# Altium project STM32_display_test_board.PrjPcb (part 2 of 2)

## Sheet Connect.SchDoc
size A3; SheetNumber: 3; SheetTotal: 3
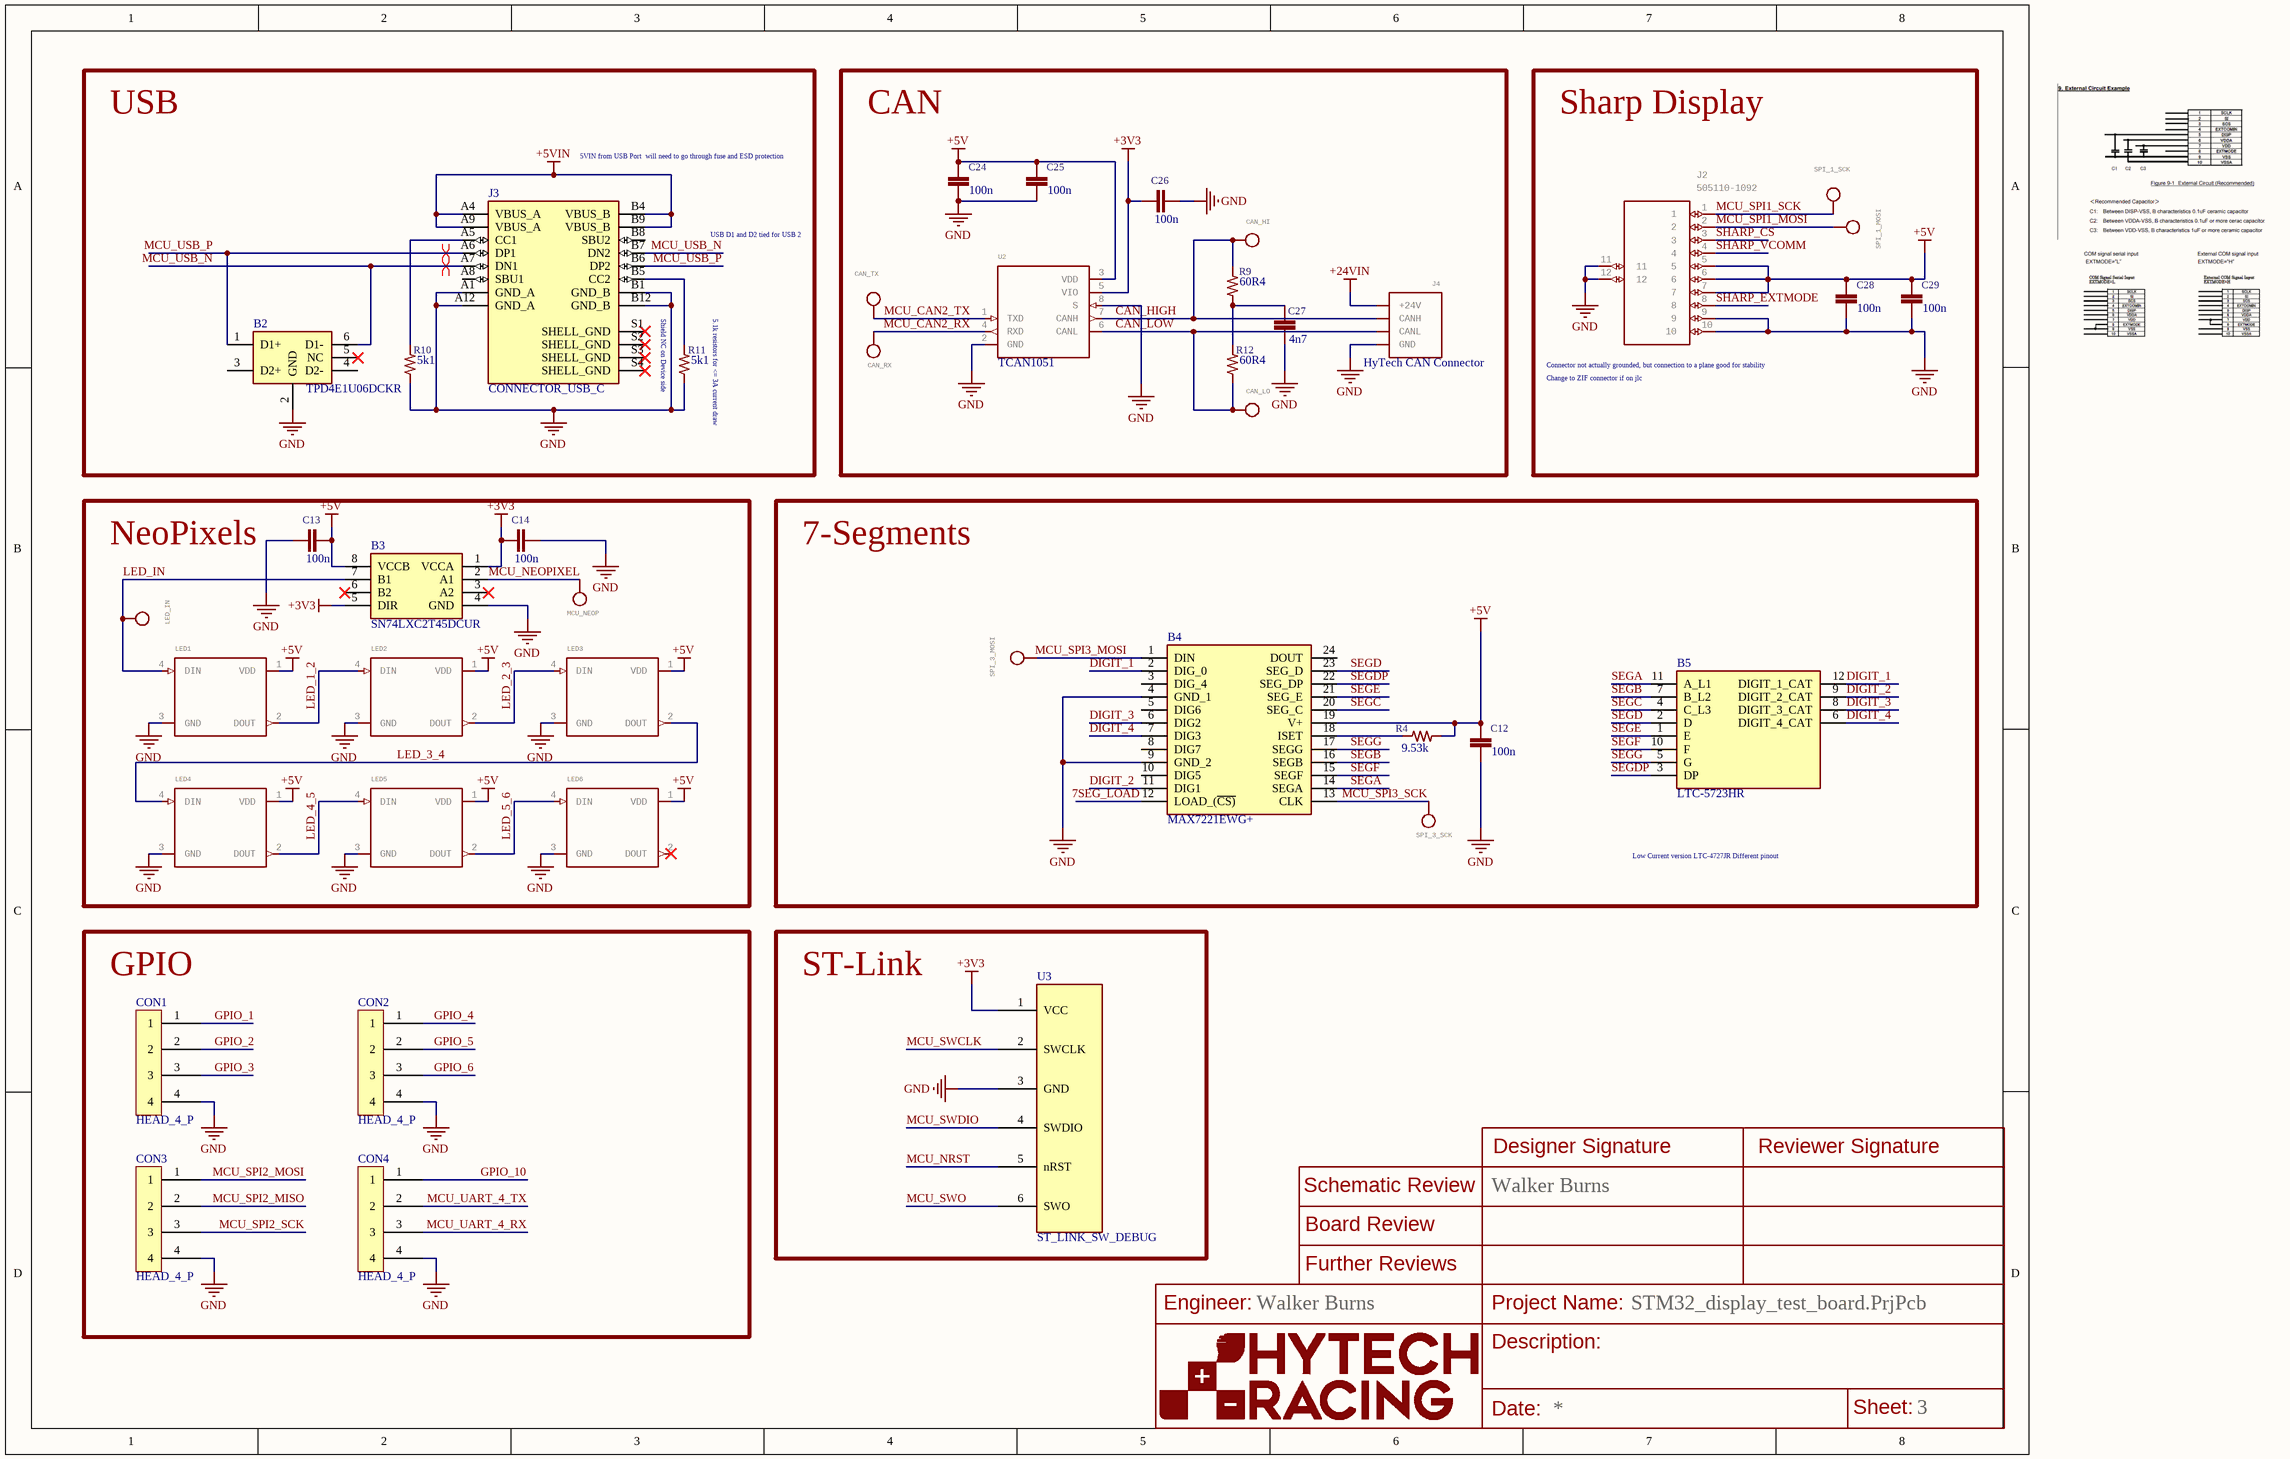
[diagram p4: Connect.SchDoc]

### Parts
B2  TPD4E1U06DCKR  [SC-70-6]
B3  SN74LXC2T45DCUR  [VSSOP-8]
B4  MAX7221EWG+  [SOIC-24]
B5  LTC-5723HR  [7SEGMENT_DISP_12_P_TH]
C12  100n  [0402_CAP]
C13  100n  [0402_CAP]
C14  100n  [0402_CAP]
C24  100n  [0402_CAP]
C25  100n  [0402_CAP]
C26  100n  [0402_CAP]
C27  4n7  [0603-CAP]
C28  100n  [0402_CAP]
C29  100n  [0402_CAP]
CAN_HI  Test Point for Probing  [5015]  (value not drawn)
CAN_LO  Test Point for Probing  [5015]  (value not drawn)
CAN_RX  Test Point for Probing  [5015]  (value not drawn)
CAN_TX  Test Point for Probing  [5015]  (value not drawn)
CON1  HEAD_4_P  [1X04]
CON2  HEAD_4_P  [1X04]
CON3  HEAD_4_P  [1X04]
CON4  HEAD_4_P  [1X04]
FRAME3  HyTech Racing Frame (ANSI Size A)  Prints on US Letter Landscape 8.5" by 11"   Fill Engineer/Description Fields with Text using the following settings:  Size: 0.1  Ratio: 8%  Line Distance: 50%  Font: Proportional  Layer: 94 Symbol  (value not drawn)
J2  505110-1092  [MOLEX_FPC_CLAMSHELL_10]
J3  CONNECTOR_USB_C  [VALCON_USB_C]
J4  HyTech CAN Connector  [MOLEX_MICROFIT_SMD_RIGHTANGLE_04_DUAL]
LED1  IN-PI55QATPRPGPBPW-40  Neopixel RGBW LED  Datasheet  [NEOPIXEL]  (value not drawn)
LED2  IN-PI55QATPRPGPBPW-40  Neopixel RGBW LED  Datasheet  [NEOPIXEL]  (value not drawn)
LED3  IN-PI55QATPRPGPBPW-40  Neopixel RGBW LED  Datasheet  [NEOPIXEL]  (value not drawn)
LED4  IN-PI55QATPRPGPBPW-40  Neopixel RGBW LED  Datasheet  [NEOPIXEL]  (value not drawn)
LED5  IN-PI55QATPRPGPBPW-40  Neopixel RGBW LED  Datasheet  [NEOPIXEL]  (value not drawn)
LED6  IN-PI55QATPRPGPBPW-40  Neopixel RGBW LED  Datasheet  [NEOPIXEL]  (value not drawn)
LED_IN  Test Point for Probing  [5015]  (value not drawn)
MCU_NEOP  Test Point for Probing  [5015]  (value not drawn)
R4  9.53k  [0603-RES]
R9  60R4  [0603-RES]
R10  5k1  [0603-RES]
R11  5k1  [0603-RES]
R12  60R4  [0603-RES]
SPI_1_MOSI  Test Point for Probing  [5015]  (value not drawn)
SPI_1_SCK  Test Point for Probing  [5015]  (value not drawn)
SPI_3_MOSI  Test Point for Probing  [5015]  (value not drawn)
SPI_3_SCK  Test Point for Probing  [5015]  (value not drawn)
U2  TCAN1051  [SOIC-08(NARROW,0-15")]
U3  ST_LINK_SW_DEBUG  [HEADER_6_P]

### Blocks framed on the sheet
USB: B2 J3 R10 R11
CAN: C24-C27 CAN_HI CAN_LO CAN_RX CAN_TX J4 R9 R12 U2
Sharp Display: C28 C29 J2 SPI_1_MOSI SPI_1_SCK
NeoPixels: B3 C13 C14 LED1-LED6 LED_IN MCU_NEOP
7-Segments: B4 B5 C12 R4 SPI_3_MOSI SPI_3_SCK
GPIO: CON1-CON4
ST-Link: U3

### Nets
+3V3: B3.1(VCCA) B3.5(DIR) C14.2 C26.2 U2.5(VIO) U3.1(VCC)
+5V: B3.8(VCCB) B4.19(V+) C12.2 C13.1 C24.2 C25.2 C28.2 C29.2 J2.5 J2.6 J2.7 LED1.1(VDD) LED2.1(VDD) LED3.1(VDD) LED4.1(VDD) LED5.1(VDD) LED6.1(VDD) R4.2 U2.3(VDD)
+5VIN: J3.A4(VBUS_A) J3.A9(VBUS_A) J3.B4(VBUS_B) J3.B9(VBUS_B)
+24VIN: J4.1(+24V)
GND: B2.2(GND) B3.4(GND) B4.4(GND_1) B4.9(GND_2) C12.1 C13.2 C14.1 C24.1 C25.1 C26.1 C27.1 C28.1 C29.1 CON1.4 CON2.4 CON3.4 CON4.4 J2.9 J2.10 J2.11 J2.12 J3.A1(GND_A) J3.A12(GND_A) J3.B1(GND_B) J3.B12(GND_B) J4.2(GND) LED1.3(GND) LED2.3(GND) LED3.3(GND) LED4.3(GND) LED5.3(GND) LED6.3(GND) R10.2 R11.2 U2.2(GND) U2.8(S) U3.3(GND)
7SEG_LOAD: B4.12(LOAD_(~{CS)})
CAN_HIGH: CAN_HI.1 J4.4(CANH) R9.1 U2.7(CANH)
CAN_LOW: CAN_LO.1 J4.3(CANL) R12.2 U2.6(CANL)
DIGIT_1: B4.2(DIG_0) B5.12(DIGIT_1_CAT)
DIGIT_2: B4.11(DIG1) B5.9(DIGIT_2_CAT)
DIGIT_3: B4.6(DIG2) B5.8(DIGIT_3_CAT)
DIGIT_4: B4.7(DIG3) B5.6(DIGIT_4_CAT)
GPIO_1: CON1.1
GPIO_2: CON1.2
GPIO_3: CON1.3
GPIO_4: CON2.1
GPIO_5: CON2.2
GPIO_6: CON2.3
GPIO_10: CON4.1
LED_1_2: LED1.2(DOUT) LED2.4(DIN)
LED_2_3: LED2.2(DOUT) LED3.4(DIN)
LED_3_4: LED3.2(DOUT) LED4.4(DIN)
LED_4_5: LED4.2(DOUT) LED5.4(DIN)
LED_5_6: LED5.2(DOUT) LED6.4(DIN)
LED_IN: B3.7(B1) LED1.4(DIN) LED_IN.1
MCU_CAN2_RX: CAN_RX.1 U2.4(RXD)
MCU_CAN2_TX: CAN_TX.1 U2.1(TXD)
MCU_NEOPIXEL: B3.2(A1) MCU_NEOP.1
MCU_NRST: U3.5(nRST)
MCU_SPI1_MOSI: J2.2 SPI_1_MOSI.1
MCU_SPI1_SCK: J2.1 SPI_1_SCK.1
MCU_SPI2_MISO: CON3.2
MCU_SPI2_MOSI: CON3.1
MCU_SPI2_SCK: CON3.3
MCU_SPI3_MOSI: B4.1(DIN) SPI_3_MOSI.1
MCU_SPI3_SCK: B4.13(CLK) SPI_3_SCK.1
MCU_SWCLK: U3.2(SWCLK)
MCU_SWDIO: U3.4(SWDIO)
MCU_SWO: U3.6(SWO)
MCU_UART_4_RX: CON4.3
MCU_UART_4_TX: CON4.2
MCU_USB_N: B2.6(D1-) J3.A7(DN1) J3.B7(DN2)
MCU_USB_P: B2.1(D1+) J3.A6(DP1) J3.B6(DP2)
SEGA: B4.14(SEGA) B5.11(A_L1)
SEGB: B4.16(SEGB) B5.7(B_L2)
SEGC: B4.20(SEG_C) B5.4(C_L3)
SEGD: B4.23(SEG_D) B5.2(D)
SEGDP: B4.22(SEG_DP) B5.3(DP)
SEGE: B4.21(SEG_E) B5.1(E)
SEGF: B4.15(SEGF) B5.10(F)
SEGG: B4.17(SEGG) B5.5(G)
SHARP_CS: J2.3
SHARP_EXTMODE: J2.8
SHARP_VCOMM: J2.4
NetB4_18: B4.18(ISET) R4.1
NetC27_2: C27.2 R9.2 R12.1
NetJ3_A5: J3.A5(CC1) R10.1
NetJ3_B5: J3.B5(CC2) R11.1

Not connected (* = marked no-connect by the designer): B2 3(D2+) 4(D2-) 5(NC)*; B3 3(A2)* 6(B2)*; B4 3(DIG_4) 5(DIG6) 8(DIG7) 10(DIG5) 24(DOUT); J3 A8(SBU1) B8(SBU2) S1(SHELL_GND)* S2(SHELL_GND)* S3(SHELL_GND)* S4(SHELL_GND)*; LED6 2(DOUT)*

### Layout directives
differential pair: MCU_USB_N, MCU_USB_P

### Notes on the sheet
- 5VIN from USB Port  will need to go through fuse and ESD protection
- USB D1 and D2 tied for USB 2
- (near R11) Shield NC on Device side
- (near R11) 5.1k resistors for <= 3A current draw
- (near J2) Connector not actually grounded, but connection to a plane good for stability
- (near J2) Change to ZIF connector if on jlc
- Low Current version LTC-4727JR Different pinout
- (in symbol FRAME) Designer Signature; Reviewer Signature; Schematic Review; Board Review; Further Reviews; Engineer:; Project Name:; Description:; Date:; Sheet:

### Library data of the parts
B2 = TPD4E1U06DCKR: Quad-Channel High-Speed ESD Protection Device; Manufacturer_Name: Texas Instruments; Geometry.Height: 1.1mm; Mouser Part Number: 595-TPD4E1U06DCKR; Mouser Price/Stock: https://www.mouser.co.uk/ProductDetail/Texas-Instruments/TPD4E1U06DCKR?qs=FBI%252BX3tnPf27UOVCu86Dnw%3D%3D; Manufacturer_Part_Number: TPD4E1U06DCKR; Datasheet Link: http://www.ti.com/lit/gpn/tpd4e1u06
B3 = LEVEL_SHIFTER_3V3_TO_5V: Translation - Voltage Levels 2-bit dual supply transceiver with configurable voltage-level shifting and 3-state outputs; Manufacturer_Name: Texas Instruments; Geometry.Height: 0.9mm; Mouser Part Number: 595-SN74LXC2T45DCUR; Mouser Price/Stock: https://www.mouser.co.uk/ProductDetail/Texas-Instruments/SN74LXC2T45DCUR?qs=TCDPyi3sCW3DKJ9sPzuW6Q%3D%3D; Manufacturer_Part_Number: SN74LXC2T45DCUR; Datasheet Link: https://www.ti.com/lit/ds/symlink/sn74lxc2t45.pdf?ts=1639472823475&ref_url=https%253A%252F%252Fwww.ti.com%252Fproduct%252FSN74LXC2T45%253FkeyMatch%253DSN74LXC2T45DCUR%2526tisearch%253Dsearch-everything%2526usecase%253DOPN
B4 = MAX7221EWG+: MAX7221EWG+, LED Display Driver, 8-Digits 64-Segments, 4  5.5 V, 24-Pin SOIC W; Manufacturer_Name: Analog Devices; Geometry.Height: 2.65mm; Mouser Part Number: 700-MAX7221EWG; Mouser Price/Stock: https://www.mouser.co.uk/ProductDetail/Analog-Devices-Maxim-Integrated/MAX7221EWG%2b?qs=1THa7WoU59EcwjgGV%252Bu7MA%3D%3D; Manufacturer_Part_Number: MAX7221EWG+; Datasheet Link: http://datasheets.maximintegrated.com/en/ds/MAX7219-MAX7221.pdf
B5 = LED_7_SEGMENT_4_DIGIT: LED Displays & Accessories 4 Digit, Red Normal Current, Common  Cathode; Manufacturer_Name: Lite-On; Manufacturer_Part_Number: LTC-4627JR; Geometry.Height: 7.25mm; Mouser Part Number: 859-LTC-4627JR; Mouser Price/Stock: https://www.mouser.co.uk/ProductDetail/Lite-On/LTC-4627JR?qs=WxFF5lh7QM3%252BoGt5Rn2nWQ%3D%3D; Datasheet Link: https://componentsearchengine.com/Datasheets/1/LTC-4627JR.pdf
C12-C14 C24-C26 C28 C29 = CAPACITOR_?_*0402: MANUFACTURER: Yageo; MPN: CC0603KRX7R0BB104; MPN: CC0603KRX7R0BB103; MANUFACTURER: KEMET; MPN: C0603C823K8RACTU; MANUFACTURER: Vishay Vitramon; MPN: VJ0603Y104JXQPW1BC; MPN: VJ0603Y224JXQCW1BC; MPN: CC0603KRX7R6BB103; MPN: VJ0603A150FXQPW1BC; MPN: CC0603KRX7R6BB105; MANUFACTURER: Murata Electronics; MPN: GRM188R61A226ME15D; MANUFACTURER: Würth Elektronik; MPN: 885012006016; MPN: 885012206012; MANUFACTURER: Samsung Electro-Mechanics; MPN: CL10A475KP8NNNC; MPN: 885012006013; MPN: C0603C683K8RACTU; MANUFACTURER: Kyocera AVX; MPN: 0201ZA820JAT2A; MPN: CL10B104KA8NNNC; MANUFACTURER: Walsin Technology Corporation; MPN: 0603B224K250CT; MPN: CC0603KRX7R8BB122; MPN: GRM188R61E106MA73D; MPN: CL10B105KA8NNNC; MANUFACTURER: TDK Corporation; MPN: C1608X5R1E475K080AC; MPN: 06033C473K4Z2A; MANUFACTURER: Taiyo Yuden; MPN: GMK107B7104KAHT; MPN: C1608X7R1V224K080AB; MPN: C1608X7R1V105K080AE; MPN: CC0603KRX7R9BB104; MPN: C1608C0G1H103J080AA; MPN: UMK107BJ105KA-T; MPN: CL10B471JB8NNNC; GateName_1: G$1; DeviceName: 0603; CAPACITANCE: 0.1µF; DKPN: 311-1523-1-ND; MOPN: 603-CC603KRX7R0BB104; TOLERANCE: 10%; VOLTAGE: 100V; CAPACITANCE: 10nF; DKPN: 311-1788-1-ND; MOPN: 603-CC603KRX7R0BB103; CAPACITANCE: 0.082µF; DKPN: 399-17417-2-ND; MOPN: 80-C0603C823K8R; VOLTAGE: 10V; DKPN: 720-1688-1-ND; MOPN: 77-VJ0603Y104JXQPBC; TOLERANCE: 5%; CAPACITANCE: 0.22µF; DKPN: 720-VJ0603Y224JXQCW1BCTR-ND; MOPN: 77-VJ0603Y224JXQCBC; DKPN: 311-4054-1-ND; MOPN: 603-CC603KRX7R6BB103; CAPACITANCE: 15pF; DKPN: 720-VJ0603A150FXQPW1BCCT-ND; MOPN: 77-VJ0603A150FXQPBC; TOLERANCE: 1%; CAPACITANCE: 1µF; DKPN: 311-1796-1-ND; MOPN: 603-CC603KRX7R6BB105; CAPACITANCE: 22µF; DKPN: 490-10476-1-ND; MOPN: 81-GRM188R61A226ME5D; TOLERANCE: 20%; CAPACITANCE: 3.3nF; DKPN: 732-7759-1-ND; MOPN: 710-885012006016; CAPACITANCE: 4.7nF; DKPN: 732-7931-1-ND; MOPN: 710-885012206012; CAPACITANCE: 4.7µF; DKPN: 1276-1044-1-ND; MOPN: 187-CL10A475KP8NNNC; CAPACITANCE: 680pF; DKPN: 732-7757-1-ND; MOPN: 710-885012006013; CAPACITANCE: 68nF; DKPN: 399-C0603C683K8RAC7867CT-ND; MOPN: 80-C0603C683K8R; CAPACITANCE: 82pF; DKPN: 478-1025-1-ND; MOPN: 581-0201ZA820JAT2A; DKPN: 1276-1006-1-ND; MOPN: 187-CL10B104KA8NNNC; VOLTAGE: 25V; DKPN: 1292-1420-1-ND; MOPN: 791-0603B224K250CT; CAPACITANCE: 1.2nF; DKPN: 311-4079-2-ND; MOPN: 603-CC603KRX7R8BB122; CAPACITANCE: 10µF; DKPN: 490-7202-1-ND; MOPN: 81-GRM188R61E106MA3D; DKPN: 1276-1184-1-ND; MOPN: 187-CL10B105KA8NNNC; CAPACITANCE: 4.7uF; DKPN: 445-9050-1-ND; MOPN: 810-C1608X5R1E475K; CAPACITANCE: 47nF; DKPN: 478-6340-1-ND; MOPN: 581-06033C473K42ZA; DKPN: 587-3354-1-ND; MOPN: 963-GMK107B7104KAHT; VOLTAGE: 35V; DKPN: 445-14239-1-ND; MOPN: 810-C1608X7R1V224K0B; DKPN: 445-173625-1-ND; MOPN: 810-C1608X7R1V105KAE; DKPN: 311-1344-1-ND; MOPN: 603-CC603KRX7R9BB104; VOLTAGE: 50V; DKPN: 445-7404-1-ND; MOPN: 810-C1608C0G1H103J; CAPACITANCE: 1uF; DKPN: 587-2400-2-ND; MOPN: 963-UMK107BJ105KA-T; CAPACITANCE: 470pF; DKPN: 1276-2058-1-ND; MOPN: 187-CL10B471JB8NNNC; CAPACITANCE: 47pF; DKPN: 445-12417-1-ND; MOPN: CGA3E2NP01H470J080AA; SymbolName_1: CAPACITOR; LibraryName: HyTechDevices; DeviceSetName: CAPACITOR_?_*; Package: 0603-CAP; MANUFACTURER: YAGEO; MPN: CGA3E2NP01H470J080AA
C27 = CAPACITOR_?_*0603: MANUFACTURER: Yageo; MPN: CC0603KRX7R0BB104; MPN: CC0603KRX7R0BB103; MANUFACTURER: KEMET; MPN: C0603C823K8RACTU; MANUFACTURER: Vishay Vitramon; MPN: VJ0603Y104JXQPW1BC; MPN: VJ0603Y224JXQCW1BC; MPN: CC0603KRX7R6BB103; MPN: VJ0603A150FXQPW1BC; MPN: CC0603KRX7R6BB105; MANUFACTURER: Murata Electronics; MPN: GRM188R61A226ME15D; MANUFACTURER: Würth Elektronik; MPN: 885012006016; MPN: 885012206012; MANUFACTURER: Samsung Electro-Mechanics; MPN: CL10A475KP8NNNC; MPN: 885012006013; MPN: C0603C683K8RACTU; MANUFACTURER: Kyocera AVX; MPN: 0201ZA820JAT2A; MPN: CL10B104KA8NNNC; MANUFACTURER: Walsin Technology Corporation; MPN: 0603B224K250CT; MPN: CC0603KRX7R8BB122; MPN: GRM188R61E106MA73D; MPN: CL10B105KA8NNNC; MANUFACTURER: TDK Corporation; MPN: C1608X5R1E475K080AC; MPN: 06033C473K4Z2A; MANUFACTURER: Taiyo Yuden; MPN: GMK107B7104KAHT; MPN: C1608X7R1V224K080AB; MPN: C1608X7R1V105K080AE; MPN: CC0603KRX7R9BB104; MPN: C1608C0G1H103J080AA; MPN: UMK107BJ105KA-T; MPN: CL10B471JB8NNNC; GateName_1: G$1; DeviceName: 0603; CAPACITANCE: 0.1µF; DKPN: 311-1523-1-ND; MOPN: 603-CC603KRX7R0BB104; TOLERANCE: 10%; VOLTAGE: 100V; CAPACITANCE: 10nF; DKPN: 311-1788-1-ND; MOPN: 603-CC603KRX7R0BB103; CAPACITANCE: 0.082µF; DKPN: 399-17417-2-ND; MOPN: 80-C0603C823K8R; VOLTAGE: 10V; DKPN: 720-1688-1-ND; MOPN: 77-VJ0603Y104JXQPBC; TOLERANCE: 5%; CAPACITANCE: 0.22µF; DKPN: 720-VJ0603Y224JXQCW1BCTR-ND; MOPN: 77-VJ0603Y224JXQCBC; DKPN: 311-4054-1-ND; MOPN: 603-CC603KRX7R6BB103; CAPACITANCE: 15pF; DKPN: 720-VJ0603A150FXQPW1BCCT-ND; MOPN: 77-VJ0603A150FXQPBC; TOLERANCE: 1%; CAPACITANCE: 1µF; DKPN: 311-1796-1-ND; MOPN: 603-CC603KRX7R6BB105; CAPACITANCE: 22µF; DKPN: 490-10476-1-ND; MOPN: 81-GRM188R61A226ME5D; TOLERANCE: 20%; CAPACITANCE: 3.3nF; DKPN: 732-7759-1-ND; MOPN: 710-885012006016; CAPACITANCE: 4.7nF; DKPN: 732-7931-1-ND; MOPN: 710-885012206012; CAPACITANCE: 4.7µF; DKPN: 1276-1044-1-ND; MOPN: 187-CL10A475KP8NNNC; CAPACITANCE: 680pF; DKPN: 732-7757-1-ND; MOPN: 710-885012006013; CAPACITANCE: 68nF; DKPN: 399-C0603C683K8RAC7867CT-ND; MOPN: 80-C0603C683K8R; CAPACITANCE: 82pF; DKPN: 478-1025-1-ND; MOPN: 581-0201ZA820JAT2A; DKPN: 1276-1006-1-ND; MOPN: 187-CL10B104KA8NNNC; VOLTAGE: 25V; DKPN: 1292-1420-1-ND; MOPN: 791-0603B224K250CT; CAPACITANCE: 1.2nF; DKPN: 311-4079-2-ND; MOPN: 603-CC603KRX7R8BB122; CAPACITANCE: 10µF; DKPN: 490-7202-1-ND; MOPN: 81-GRM188R61E106MA3D; DKPN: 1276-1184-1-ND; MOPN: 187-CL10B105KA8NNNC; CAPACITANCE: 4.7uF; DKPN: 445-9050-1-ND; MOPN: 810-C1608X5R1E475K; CAPACITANCE: 47nF; DKPN: 478-6340-1-ND; MOPN: 581-06033C473K42ZA; DKPN: 587-3354-1-ND; MOPN: 963-GMK107B7104KAHT; VOLTAGE: 35V; DKPN: 445-14239-1-ND; MOPN: 810-C1608X7R1V224K0B; DKPN: 445-173625-1-ND; MOPN: 810-C1608X7R1V105KAE; DKPN: 311-1344-1-ND; MOPN: 603-CC603KRX7R9BB104; VOLTAGE: 50V; DKPN: 445-7404-1-ND; MOPN: 810-C1608C0G1H103J; CAPACITANCE: 1uF; DKPN: 587-2400-2-ND; MOPN: 963-UMK107BJ105KA-T; CAPACITANCE: 470pF; DKPN: 1276-2058-1-ND; MOPN: 187-CL10B471JB8NNNC; CAPACITANCE: 47pF; DKPN: 445-12417-1-ND; MOPN: CGA3E2NP01H470J080AA; SymbolName_1: CAPACITOR; LibraryName: HyTechDevices; DeviceSetName: CAPACITOR_?_*; Package: 0603-CAP; MANUFACTURER: YAGEO; MPN: CGA3E2NP01H470J080AA
CAN_HI CAN_LO CAN_RX CAN_TX LED_IN MCU_NEOP SPI_1_MOSI SPI_1_SCK SPI_3_MOSI SPI_3_SCK = TEST_POINT: MANUFACTURER: Keystone Electronics; GateName_1: G$1; DKPN: 36-5015CT-ND; MOPN: 534-5015; SymbolName_1: TEST_POINT; LibraryName: HyTechDevices; DeviceSetName: TEST_POINT; Package: 5015; MPN: 5015
CON1-CON4 = CONNECTOR_HEADER_4: 4 Pin Standard Header
FRAME3 = FRAME: GateName_1: O; SymbolName_1: FRAME; LibraryName: HyTechFrames; DeviceSetName: FRAME
J2 = CONNECTOR-10_MOLEX_FPC_CLAMSHELL: Manufacturer_Name: Molex; GateName_1: G$1; SymbolName_1: 505110-1092; LibraryName: 505110-1092; DeviceSetName: 505110-1092; Package: 5051101092; Mouser_Part_Number: 538-505110-1092; Mouser_Price-Stock: https://www.mouser.co.uk/ProductDetail/Molex/505110-1092?qs=BA62vJVifGrjJfo6A8tlOw%3D%3D; Manufacturer_Part_Number: 505110-1092; Height: 0mm
J3 = CONNECTOR_USB_C: CSP-USC16-TR Valcon USB Type C Surface Mount PCB Socket; SnapEDA_Link: https://www.snapeda.com/parts/CSP-USC16-TR/Valcon/view-part/?ref=snap; MF: Valcon; MP: CSP-USC16-TR; Availability: In Stock; Price: None; Value: *; Check_prices: https://www.snapeda.com/parts/CSP-USC16-TR/Valcon/view-part/?ref=eda; Package: None; Purchase-URL: https://pricing.snapeda.com/search/part/CSP-USC16-TR/?ref=eda
J4 = CONNECTOR-CAN_?_*μF_S_RA: MANUFACTURER: Molex; MPN: 0430450411; GateName_1: G$1; SymbolName_1: CONNECTOR_CAN; DKPN: WM1832CT-ND; MOPN: 538-43045-0411; DeviceName: μF_S_RA; LibraryName: HyTechDevices; DeviceSetName: CONNECTOR-CAN_?_*; Package: MOLEX_MICROFIT_SMD_RIGHTANGLE_04_DUAL
LED1-LED6 = NEOPIXEL_*IN-PI55QATPRPGPBPW-40: MANUFACTURER: Inolux; GateName_1: G$1; DKPN: 1830-1210-2-ND; MOPN: 743-I55QATPRPGPBPW40; SymbolName_1: NEOPIXEL; DeviceName: IN-PI55QATPRPGPBPW-40; LibraryName: HyTechDevices; DeviceSetName: NEOPIXEL_*; Package: NEOPIXEL; MPN: IN-PI55QATPRPGPBPW-40
R4 R9-R12 = RESISTOR_?_*0603: MANUFACTURER: Yageo; MPN: RC0603FR-070RL; MANUFACTURER: Panasonic Electronic Components; MPN: ERJ-3BWFR020V; MPN: RL0603FR-070R5L; MPN: ERJ-3EKF1131V; MANUFACTURER: Vishay Dale; MPN: CRCW06031M13FKEA; MPN: RC0603FR-071K24L; MPN: ERA-3AEB1331V; MPN: RC0603FR-071M5L; MANUFACTURER: TE Conductivity Passive Product; MPN: CPF0603B1R62E1; MPN: RC0603FR-071K65L; MPN: RC0603FR-0710RL; MPN: ERA-3AEB1022V; MPN: ERA-3AEB1052V; MPN: RC0603FR-07100RL; MPN: RC0603FR-07100KL; MPN: ERA-3ARB103V; MPN: ERA-3AEB1132V; MPN: ERA-3AEB1152V; MPN: ERJ-PB3B1242V; MPN: ERA-3AEB121V; MPN: RC0603FR-0712KL; MPN: ERJ-1GNF13R0C; MPN: ERJ-PB3B1332V; MPN: ERA-3ARW133V; MPN: RT0603BRB0714KL; MPN: CRCW060315R0FKEAHP; MPN: ERA-3AEB154V; MPN: ERA-3AEB1543V; MPN: ERA-3ARB153V; MPN: RC0603FR-0717K8L; MPN: RC0603FR-0718K7L; MPN: RC0603FR-07180RL; MANUFACTURER: TE Connectivity Passive Product; MPN: CPF-A-0603B1K0E; MPN: RC0603FR-071ML; MPN: RT0805BRD072K18L; MPN: RC0603FR-072K55L; MPN: ERJ-PB3B2741V; MPN: RC0603FR-0720KL; MPN: ERJ-PB3B2100V; MPN: ERA-3AEB2153V; MPN: RC0603FR-0722RL; MPN: ERA-3AEB2212V; MPN: RC0603FR-07240RL; MANUFACTURER: Panasonic Electronic Company; MPN: ERA-3AEB2553V; MPN: ERJ-UP3F2001V; MPN: ERJ-3RQF3R3V; MPN: RT0603BRD073K32L; MPN: ERJ-PB3D3301V; MPN: RC0603FR-073K9L; MPN: ERJ-PB3B3092V; MPN: ERA-3ARB303V; MPN: ERJ-PB3B3322V; MPN: ERA-3AEB334V; MANUFACTURER: Rohm Semiconductor; MPN: KTR03EZPF3302; MPN: RC0603FR-0736K5L; MPN: RC0603FR-07360RL; MPN: KTR03EZPF3603; MPN: RC0603FR-07374KL; MPN: RT0603BRD0739RL; MPN: ERA-3AEB4121V; MPN: RC0603FR-074K64L; MPN: RC0603FR-07402RL; MPN: ERJ-1GNF41R2C; MPN: ERJ-PB3B4122V; MPN: RC0603FR-0743KL; MPN: ERJ-PA3F4700V; MPN: ERJ-P03J5R1V; MPN: RC0603FR-075K1L; MPN: RN73C1J5R49BTD; MPN: ERJ-PB3D5491V; MPN: ERA-3AEB5901V; MPN: RT0603BRE0750RL; MPN: KTR03EZPF5103; MPN: RC0603FR-0760R4L; MPN: RC0603FR-07620RL; MPN: ERA-3AEB7322V; MPN: RT0603BRE0775KL; MANUFACTURER: Vishay Dale Thin Film; MPN: PTN0603E8351BST1; MPN: RT0603BRD078K66L; MPN: ERA-3AEB8452V; MPN: ERJ-PB3B9312V; MANUFACTURER: Rohm; MPN: KTR03EZPF3301; MPN: KTR03EZPF7502; MPN: KTR03EZPF7503; GateName_1: G$1; DeviceName: 0603; DKPN: 311-0.0HRCT-ND; MOPN: 603-RC0603FR-070RL; POWER: 0.1W; RESISTANCE: 0; TOLERANCE: 1%; VOLTAGE_CONTINUOUS: 75V; DKPN: P17461CT-ND; MOPN: 667-ERJ-3BWFR020V; POWER: 0.33W; RESISTANCE: 0.02; VOLTAGE_CONTINUOUS: 0.081V; VOLTAGE_MAX: 150V; DKPN: 311-.5QTR-ND; MOPN: 603-RL0603FR070R5L; RESISTANCE: 0.5; VOLTAGE_CONTINUOUS: 0.22V; DKPN: P1.13KHCT-ND; MOPN: 667-ERJ-3EKF1131V; RESISTANCE: 1.13k; DKPN: 541-1.13MHCT-ND; MOPN: 71-CRCW06031M13FKEA; RESISTANCE: 1.13M; VOLTAGE_MAX: 100V; DKPN: 311-1.24KHRCT-ND; MOPN: 603-RC0603FR-071K24L; RESISTANCE: 1.24k; VOLTAGE_CONTINUOUS: 11.14V; DKPN: P1.33KDBCT-ND; MOPN: 667-ERA-3AEB1331V; RESISTANCE: 1.33k; TOLERANCE: 0.1%; VOLTAGE_CONTINUOUS: 11.53V; DKPN: 311-1.50MHRCT-ND; MOPN: 603-RC0603FR-071M5L; RESISTANCE: 1.5M; DKPN: 1712-CPF0603B1R62E1TR-ND; MOPN: 279-CPF0603B1R62E1; RESISTANCE: 1.62; VOLTAGE_CONTINUOUS: 0.51V; VOLTAGE_MAX: 50V; DKPN: 311-1.65KHRCT-ND; MOPN: 603-RC0603FR-071K65L; RESISTANCE: 1.65k; VOLTAGE_CONTINUOUS: 12.85V; DKPN: 311-10.0HRCT-ND; MOPN: 603-RC0603FR-0710RL; RESISTANCE: 10; VOLTAGE_CONTINUOUS: 1.00V; DKPN: P10.2KDBCT-ND; MOPN: 667-ERA-3AEB1022V; RESISTANCE: 10.2k; VOLTAGE_CONTINUOUS: 31.94V; DKPN: P10.5KDBCT-ND; MOPN: 677-ERA-3AEB1052V; RESISTANCE: 10.5k; VOLTAGE_CONTINUOUS: 32.40V; DKPN: 311-100HRCT-ND; MOPN: 603-RC0603FR-07100RL; RESISTANCE: 100; VOLTAGE_CONTINUOUS: 3.16V; DKPN: 311-100KHRTR-ND; MOPN: 603-RC0603FR-07100KL; RESISTANCE: 100k; DKPN: P10KBDCT-ND; MOPN: 667-ERA-3ARB103V; RESISTANCE: 10k; VOLTAGE_CONTINUOUS: 31.62V; DKPN: P11.3KDBCT-ND; MOPN: 667-ERA-3AEB1132V; RESISTANCE: 11.3k; VOLTAGE_CONTINUOUS: 33.62V; DKPN: P11.5KDBCT-ND; MOPN: 667-ERA-3AEB1152V; RESISTANCE: 11.5k; VOLTAGE_CONTINUOUS: 33.91V; DKPN: P20096CT-ND; MOPN: 667-ERJ-PB3B1242V; POWER: 0.2W; RESISTANCE: 12.4k; VOLTAGE_CONTINUOUS: 49.79V; DKPN: P120DBCT-ND; MOPN: 667-ERA-3AEB121V; RESISTANCE: 120; VOLTAGE_CONTINUOUS: 3.46V; DKPN: 311-12.0KHRCT-ND; MOPN: 603-RC0603FR-0712KL; RESISTANCE: 12k; VOLTAGE_CONTINUOUS: 34.64V; DKPN: P122724CT-ND; MOPN: 667-ERJ-1GNF13R0C; POWER: 0.05W; RESISTANCE: 13; VOLTAGE_CONTINUOUS: 25V; DKPN: P20099TR-ND; MOPN: 667-ERJ-PB3B1332V; RESISTANCE: 13.3k; VOLTAGE_CONTINUOUS: 51.58V; VOLTAGE_MAX: 75k; DKPN: P13KBECT-ND; MOPN: 667-ERA-3ARW133V; RESISTANCE: 13k; TOLERANCE: 0.05%; DKPN: RT0603BRB0714KL-ND; MOPN: 603-RT0603BRB0714KL; RESISTANCE: 14k; VOLTAGE_CONTINUOUS: 37.4V; DKPN: 541-15.0STR-ND; MOPN: 71-CRCW060315R0FKEAH; RESISTANCE: 15; VOLTAGE_CONTINUOUS: 2.22V; DKPN: P150KDBCT-ND; MOPN: 667-ERA-3AEB154V; RESISTANCE: 150k; DKPN: P154KDBCT-ND; MOPN: 667-ERA-3AEB1543V; RESISTANCE: 154k; DKPN: P15KBDCT-ND; MOPN: 667-ERA-3ARB153V; RESISTANCE: 15k; VOLTAGE_CONTINUOUS: 38.73V; DKPN: 311-17.8KHRCT-ND; MOPN: 603-RC0603FR-0717K8L; RESISTANCE: 17.8k; VOLTAGE_CONTINUOUS: 42.19V; DKPN: 311-18.7KHRCT-ND; MOPN: 603-RC0603FR-0718K7L; RESISTANCE: 18.7k; VOLTAGE_CONTINUOUS: 43.24V; DKPN: 311-180HRCT-ND; MOPN: 603-RC0603FR-07180RL; RESISTANCE: 180; VOLTAGE_CONTINUOUS: 4.24V; DKPN: 1712-CPF-A-0603B1K0ETR-ND; MOPN: 279-CPF-A-0603B1K0E; POWER: 0.0625W; RESISTANCE: 1k; VOLTAGE_CONTINUOUS: 7.9V; DKPN: 311-1.00MHRCT-ND; MOPN: 603-RC0603FR-071ML; RESISTANCE: 1M; DKPN: 13-RT0805BRD072K18LTR-ND; MOPN: 603-RT0805BRD072K18L; POWER: 0.125W; RESISTANCE: 2.18k; VOLTAGE_CONTINUOUS: 16.51V; DKPN: 311-2.55KHRCT-ND; MOPN: 603-RC0603FR-072K55L; RESISTANCE: 2.55k; VOLTAGE_CONTINUOUS: 15.97V; DKPN: P20020CT-ND; MOPN: 667-ERJ-PB3B2741V; RESISTANCE: 2.74k; VOLTAGE_CONTINUOUS: 23.41V; DKPN: 311-20.0KHRTR-ND; MOPN: 603-RC0603FR-0720KL; POWER: 0.1 W; RESISTANCE: 20k; VOLTAGE_CONTINUOUS: 44.72V; DKPN: P19892CT-ND; MOPN: 667-ERJ-PB3B2100V; RESISTANCE: 210; VOLTAGE_CONTINUOUS: 6.48V; DKPN: P215KDBCT-ND; MOPN: 667-ERA-3AEB2153V; RESISTANCE: 215k; DKPN: 311-22.0HRCT-ND; MOPN: 603-RC0603FR-0722RL; RESISTANCE: 22; VOLTAGE_CONTINUOUS: 1.48V; DKPN: P22.1KDBCT-ND; MOPN: 667-ERA-3AEB2212V; RESISTANCE: 22.1k; VOLTAGE_CONTINUOUS: 47.01V; DKPN: 311-240HRCT-ND; MOPN: 603-RC0603FR-07240RL; RESISTANCE: 240; VOLTAGE_CONTINUOUS: 4.90V; DKPN: P255KDBCT-ND; MOPN: 667-ERA-3AEB2553V; RESISTANCE: 255k; DKPN: 10-ERJ-UP3F2001VTR-ND; MOPN: 667-ERJ-UP3F2001V; POWER: 0.25W; RESISTANCE: 2k; VOLTAGE_CONTINUOUS: 22.36V; DKPN: P3.3AJTR-ND; MOPN: 667-ERJ-3RQF3R3V; RESISTANCE: 3.3; VOLTAGE_CONTINUOUS: 0.57V; DKPN: YAG1651TR-ND; MOPN: 603-RT0603BRD073K32L; RESISTANCE: 3.32k; VOLTAGE_CONTINUOUS: 18.22V; DKPN: P20340TR-ND; MOPN: 667-ERJ-PB3D3301V; POWER: 0.3W; RESISTANCE: 3.3k; TOLERANCE: 0.5%; VOLTAGE_CONTINUOUS: 25.69V; VOLTAGE_MAX: 150; DKPN: 311-3.90KHRCT-ND; MOPN: 603-RC0603FR-073K9L; RESISTANCE: 3.9k; VOLTAGE_CONTINUOUS: 19.75V; DKPN: P20140CT-ND; MOPN: 667-ERJ-PB3B3092V; RESISTANCE: 30.9k; VOLTAGE_MAX: 200V; DKPN: P30KBDCT-ND; MOPN: 667-ERA-3ARB303V; RESISTANCE: 30k; VOLTAGE_CONTINUOUS: 54.77V; DKPN: P20144TR-ND; MOPN: 667-ERJ-PB3B3322V; RESISTANCE: 33.2k; VOLTAGE_CONTINUOUS: 57.61V; DKPN: P330KDBCT-ND; MOPN: 667-ERA-3AEB334V; RESISTANCE: 330k; DKPN: RHM33KAYTR-ND; MOPN: 755-KTR03EZPF3302; RESISTANCE: 33k; VOLTAGE_CONTINUOUS: 57.44V; VOLTAGE_MAX: 350V; DKPN: 311-36.5KHRCT-ND; MOPN: 603-RC0603FR-0736K5L; RESISTANCE: 36.5k; VOLTAGE_CONTINUOUS: 60.42V; DKPN: 311-360HRTR-ND; MOPN: 603-RC0603FR-07360RL; RESISTANCE: 360; VOLTAGE_CONTINUOUS: 6.00V; DKPN: RHM360KAYTR-ND; MOPN: 755-KTR03EZPF3603; RESISTANCE: 360k; VOLTAGE_CONTINUOUS: 189.74V; DKPN: 311-374KHRCT-ND; MOPN: 603-RC0603FR-07374KL; RESISTANCE: 374k; DKPN: 13-RT0603BRD0739RLTR-ND; MOPN: 603-RT0603BRD0739RL; RESISTANCE: 39; VOLTAGE_CONTINUOUS: 1.97V; DKPN: P4.12KDBCT-ND; MOPN: 667-ERA-3AEB4121V; RESISTANCE: 4.12k; VOLTAGE_CONTINUOUS: 20.30V; DKPN: 311-4.64KHRCT-ND; MOPN: 603-RC0603FR-074K64L; RESISTANCE: 4.64k; VOLTAGE_CONTINUOUS: 21.54V; DKPN: 311-402HRCT-ND; MOPN: 603-RC0603FR-07402RL; RESISTANCE: 402; VOLTAGE_CONTINUOUS: 6.34V; DKPN: P123000CT-ND; MOPN: 667-ERJ-1GNF41R2C; RESISTANCE: 41.2; DKPN: P20155CT-ND; MOPN: 667-ERJ-PB3B4122V; RESISTANCE: 41.2k; DKPN: 311-43.0KHRCT-ND; MOPN: 603-RC0603FR-0743KL; RESISTANCE: 43k; VOLTAGE_CONTINUOUS: 65.57V; DKPN: P470BYCT-ND; MOPN: 667-ERJ-PA3F4700V; RESISTANCE: 470; VOLTAGE_CONTINUOUS: 10.84V; DKPN: P16039TR-ND; MOPN: 667-ERJ-P03J5R1V; RESISTANCE: 5.1; VOLTAGE_CONTINUOUS: 1.13V; DKPN: 311-5.10KHRTR-ND; MOPN: 603-RC0603FR-075K1L; RESISTANCE: 5.1k; VOLTAGE_CONTINUOUS: 22.58V; DKPN: A124665CT-ND; MOPN: 279-RN73C1J5R49BTD; RESISTANCE: 5.49; DKPN: P20367CT-ND; MOPN: 667-ERJ-PB3D5491V; RESISTANCE: 5.49k; DKPN: P5.9KDBCT-ND; MOPN: 667-ERA-3AEB5901V; RESISTANCE: 5.9k; VOLTAGE_CONTINUOUS: 24.29V; DKPN: 13-RT0603BRE0750RLCT-ND; MOPN: 603-RT0603BRE0750RL; RESISTANCE: 50; VOLTAGE_CONTINUOUS: 2.24V; DKPN: RHM510KAYTR-ND; MOPN: 755-KTR03EZPF5103; RESISTANCE: 510k; VOLTAGE_CONTINUOUS: 225.83V; DKPN: 311-60.4HRCT-ND; MOPN: 603-RC0603FR-0760R4L; RESISTANCE: 60.4; VOLTAGE_CONTINUOUS: 2.48V; DKPN: 311-620HRCT-ND; MOPN: 603-RC0603FR-07620RL; RESISTANCE: 620; VOLTAGE_CONTINUOUS: 7.87V; DKPN: P73.2KDBCT-ND; MOPN: 667-ERA-3AEB7322V; RESISTANCE: 73.2k; DKPN: RT0603BRE0775KL-ND; MOPN: 603-RT0603BRE0775KL; DKPN: 764-1461-2-ND; MOPN: 71-PTN0603E8351BST1; POWER: 0.15W; RESISTANCE: 8.35k; VOLTAGE_CONTINUOUS: 28.90V; DKPN: YAG4603TR-ND; MOPN: 603-RT0603BRD078K66L; RESISTANCE: 8.66k; VOLTAGE_CONTINUOUS: 29.43V; DKPN: P84.5KDBCT-ND; MOPN: 667-ERA-3AEB8452V; RESISTANCE: 84.5k; DKPN: P20197CT-ND; MOPN: 667-ERJ-PB3B9312V; RESISTANCE: 93.1k; VOLTAGE_CONTINUOUS: 136V; RESISTANCE: DNP; DKPN: RHM3.3KAYTR-ND; MOPN: 755-KTR03EZPF3301; VOLTAGE_CONTINUOUS: 18.17V; DKPN: RHM75KAYTR-ND; MOPN: 755-KTR03EZPF7502; RESISTANCE: 750k; VOLTAGE_CONTINUOUS: 273.86V; DKPN: RHM750KAYTR-ND; MOPN: 755-KTR03EZPF7503; VOLTAGE_CONTINUOUS: 86.60V; SymbolName_1: RESISTOR; LibraryName: HyTechDevices; DeviceSetName: RESISTOR_?_*; Package: 0603-RES; VOLTAGE_MAX: 75V; MANUFACTURER: YAGEO; VOLTAGE_CONTINUOUS: 150V; VOLTAGE_CONTINUOUS: 50V; RESISTANCE: 75k
U2 = TCAN1051*V-Q1: MANUFACTURER: Texas Instruments; MPN: TCAN1051HGVDRQ1; GateName_1: G$1; SymbolName_1: CAN_TRANSCIEVER_TCAN1051*V; DKPN: 296-49935-1-ND; MOPN: 595-TCAN1051HGVDQ1; LibraryName: HyTechDevices; DeviceSetName: TCAN1051*V-Q1; Package: SOIC-08(NARROW,0.15")
U3 = CONNECTOR_ST_LINK

## Nets that join several sheets
+3V3: MCU (14 pins), Power (6 pins), Connect (6 pins)
+5V: Power (5 pins), Connect (19 pins)
+5VIN: Power (5VIN.1 F1.1), Connect (J3.A4 J3.A9 J3.B4 J3.B9)
+24VIN: Power (24V.1), Connect (J4.1)
GND: MCU (19 pins), Power (7 pins), Connect (37 pins)
7SEG_LOAD: MCU (STM32.50), Connect (B4.12)
GPIO_1: MCU (STM32.57), Connect (CON1.1)
GPIO_2: MCU (STM32.58), Connect (CON1.2)
GPIO_3: MCU (STM32.59), Connect (CON1.3)
GPIO_4: MCU (STM32.2), Connect (CON2.1)
GPIO_5: MCU (STM32.3), Connect (CON2.2)
GPIO_6: MCU (STM32.4), Connect (CON2.3)
GPIO_10: MCU (STM32.11), Connect (CON4.1)
MCU_CAN2_RX: MCU (STM32.33), Connect (CAN_RX.1 U2.4)
MCU_CAN2_TX: MCU (STM32.34), Connect (CAN_TX.1 U2.1)
MCU_NEOPIXEL: MCU (STM32.16), Connect (B3.2 MCU_NEOP.1)
MCU_NRST: MCU (C1.2 R1.2 S2.1 STM32.7), Connect (U3.5)
MCU_SPI1_MOSI: MCU (STM32.23), Connect (J2.2 SPI_1_MOSI.1)
MCU_SPI1_SCK: MCU (STM32.21), Connect (J2.1 SPI_1_SCK.1)
MCU_SPI2_MISO: MCU (STM32.10), Connect (CON3.2)
MCU_SPI2_MOSI: MCU (STM32.9), Connect (CON3.1)
MCU_SPI2_SCK: MCU (STM32.29), Connect (CON3.3)
MCU_SPI3_MOSI: MCU (STM32.26), Connect (B4.1 SPI_3_MOSI.1)
MCU_SPI3_SCK: MCU (STM32.51), Connect (B4.13 SPI_3_SCK.1)
MCU_SWCLK: MCU (STM32.49), Connect (U3.2)
MCU_SWDIO: MCU (STM32.46), Connect (U3.4)
MCU_SWO: MCU (STM32.55), Connect (U3.6)
MCU_UART_4_RX: MCU (STM32.15), Connect (CON4.3)
MCU_UART_4_TX: MCU (STM32.14), Connect (CON4.2)
MCU_USB_N: MCU (STM32.44), Connect (B2.6 J3.A7 J3.B7)
MCU_USB_P: MCU (STM32.45), Connect (B2.1 J3.A6 J3.B6)
SHARP_CS: MCU (STM32.24), Connect (J2.3)
SHARP_EXTMODE: MCU (STM32.27), Connect (J2.8)
SHARP_VCOMM: MCU (STM32.25), Connect (J2.4)